# Altium schematic sheet HV BOX.SchDoc
size 381 x 241 mm
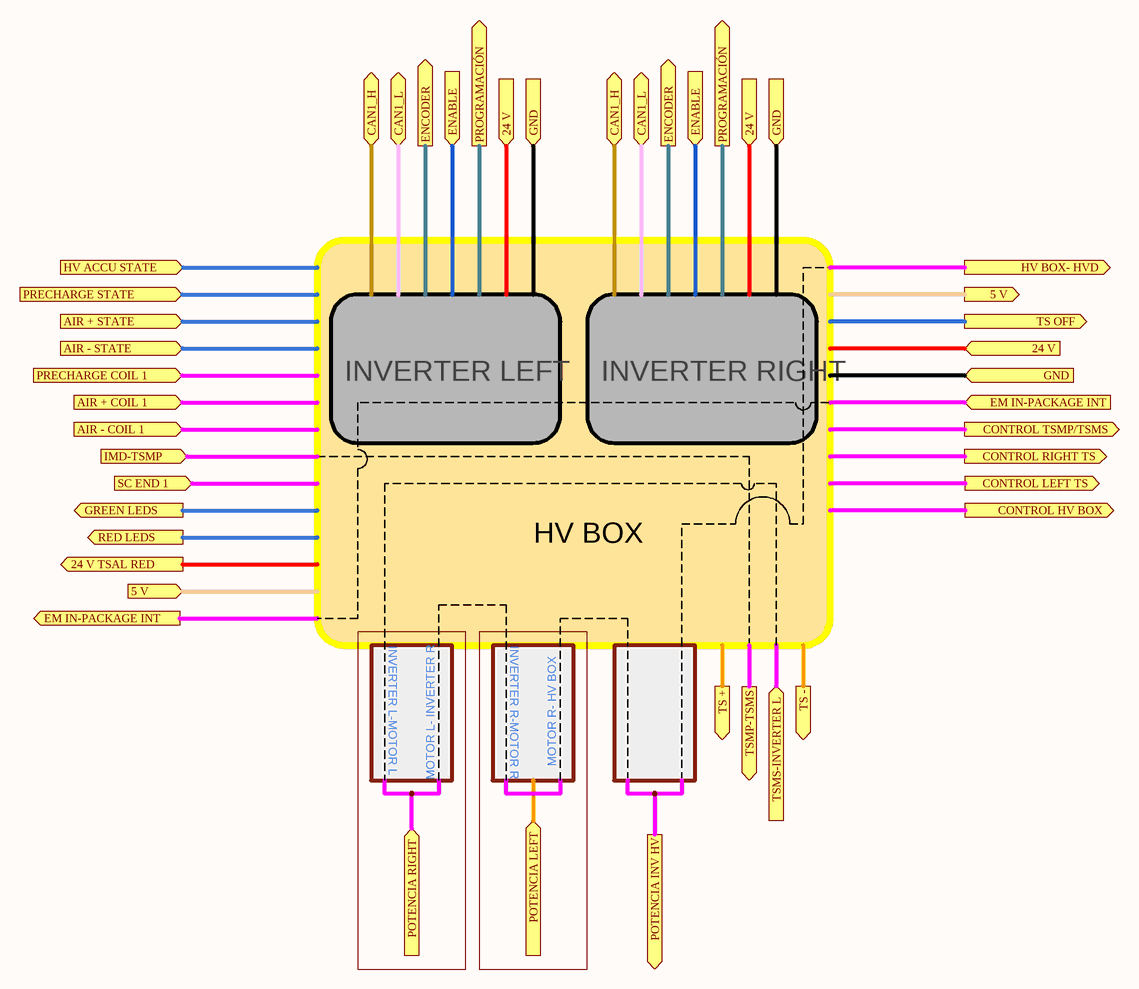
[diagram p0: HV BOX.SchDoc]

## Ports
5 V (in), 5 V (out), 24 V (in), 24 V TSAL RED (out), AIR + COIL 1 (in), AIR + STATE (in), AIR - COIL 1 (in), AIR - STATE (in), CAN1_H (bidir), CAN1_L (bidir), CONTROL HV BOX (out), CONTROL LEFT TS (out), CONTROL RIGHT TS (out), CONTROL TSMP/TSMS (out), EM IN-PACKAGE INT (in), EM IN-PACKAGE INT (out), ENABLE (in), ENCODER (out), GND (in), GREEN LEDS (out), HV ACCU STATE (in), HV BOX- HVD (out), IMD-TSMP (in), POTENCIA INV HV (out), POTENCIA LEFT (in), POTENCIA RIGHT (in), PRECHARGE COIL 1 (in), PRECHARGE STATE (in), PROGRAMACIÓN (out), RED LEDS (out), SC END 1 (in), TS + (out), TS - (out), TS OFF (out), TSMP-TSMS (out), TSMS-INVERTER L (in)

## Notes on the sheet
- INVERTER LEFT
- INVERTER RIGHT
- HV BOX
- INVERTER L-MOTOR L
- INVERTER R-MOTOR R
- MOTOR R- HV BOX
- MOTOR L- INVERTER R